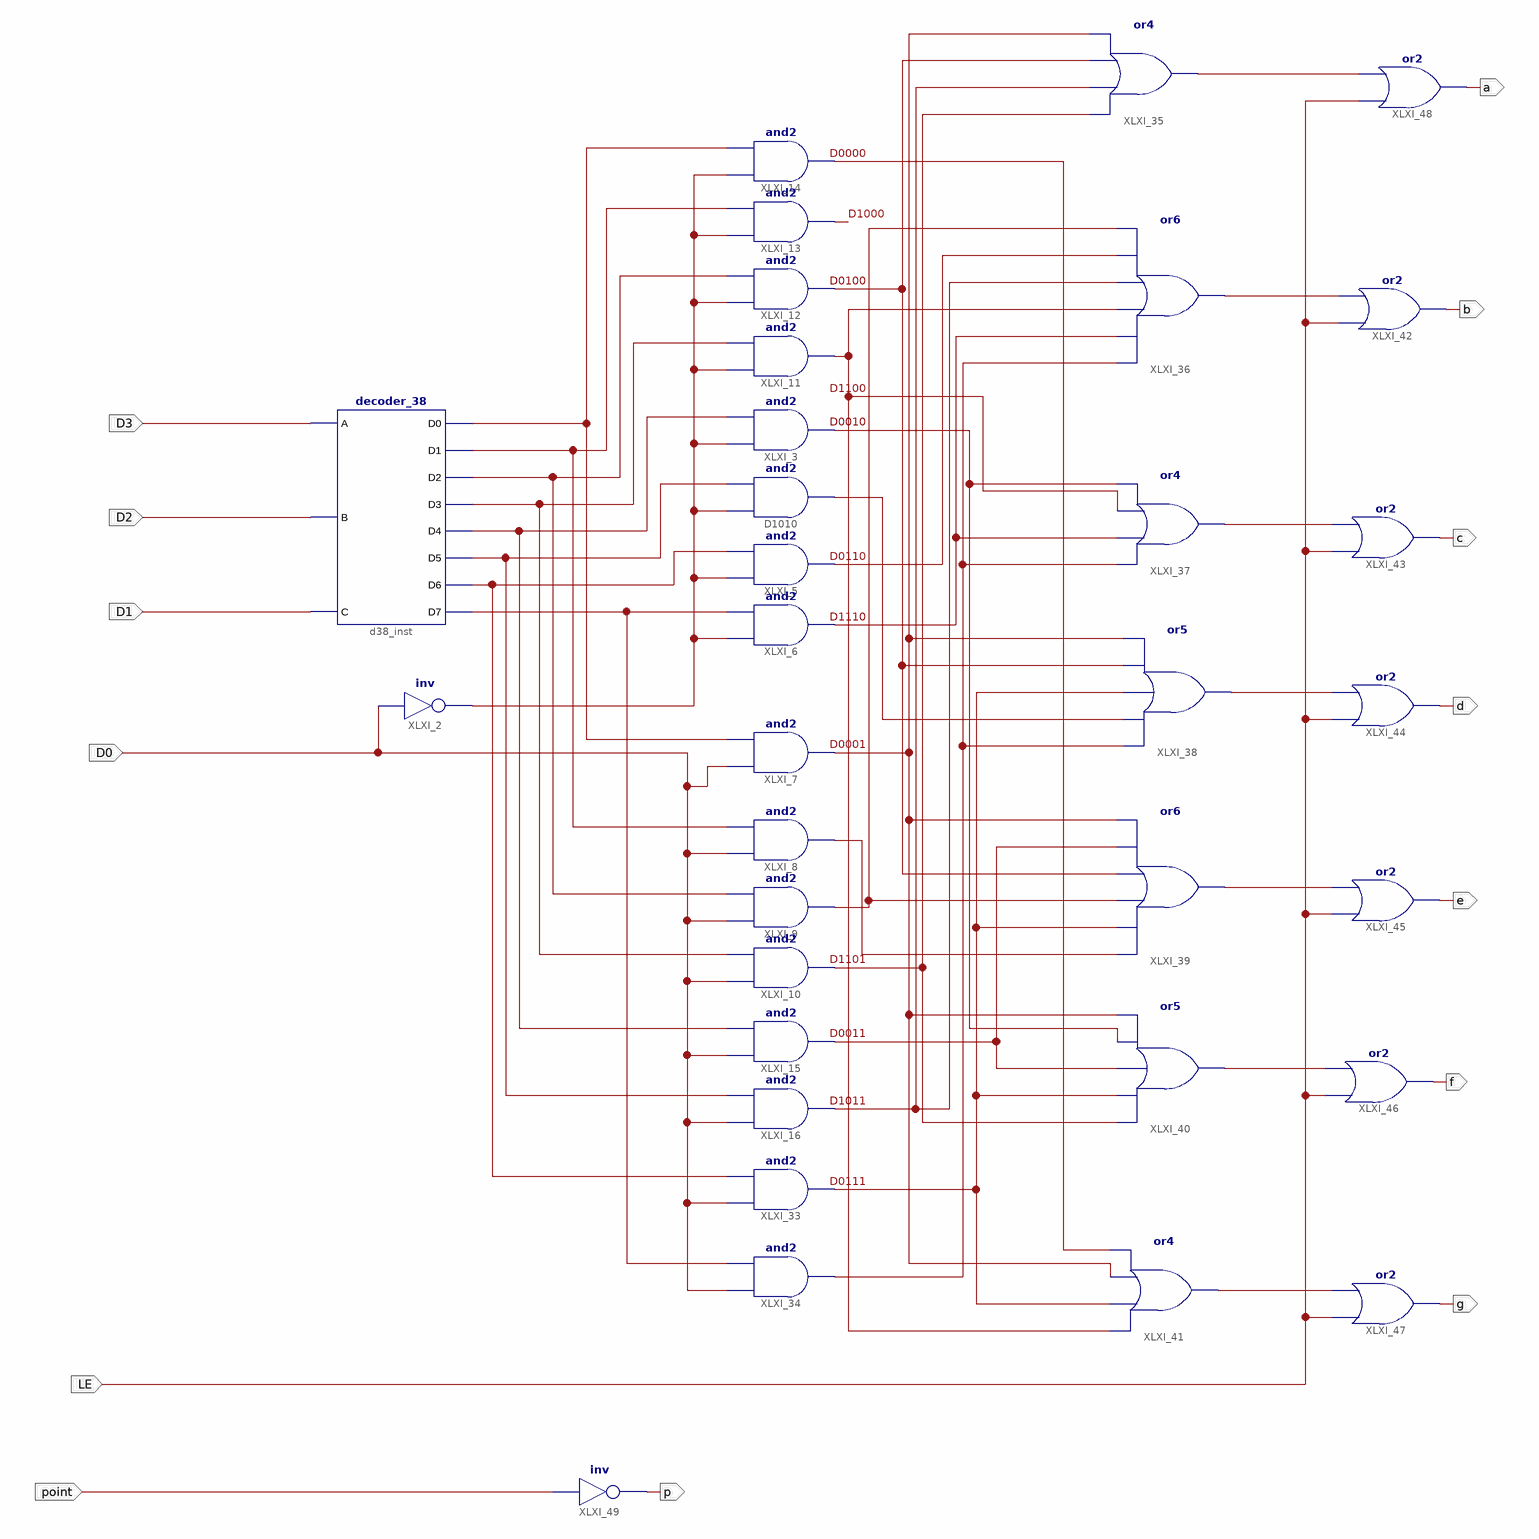
[diagram p0: schematic sheet 1]
// Xilinx ISE schematic MC14495.sch (kintex7) as structural Verilog: 33 symbols, 14 ports
module MC14495 (
  input  D3,
  input  D2,
  input  D1,
  input  D0,
  input  LE,
  input  point,
  output b,
  output c,
  output d,
  output e,
  output f,
  output g,
  output a,
  output p
);

  wire D0000, D0001, D0010, D0011, D0100, D0110, D0111, D1000, D1011, D1100, D1101, D1110, XLXN_18, XLXN_30,
       XLXN_32, XLXN_33, XLXN_34, XLXN_35, XLXN_36, XLXN_37, XLXN_38, XLXN_76, XLXN_82, XLXN_83, XLXN_84,
       XLXN_85, XLXN_86, XLXN_87, XLXN_88, XLXN_99, XLXN_100, XLXN_101;

  decoder_38 d38_inst (
    .A(D3), .B(D2), .C(D1), .D0(XLXN_30), .D1(XLXN_32), .D2(XLXN_33), .D3(XLXN_34), .D4(XLXN_35),
    .D5(XLXN_36), .D6(XLXN_37), .D7(XLXN_38));
  not XLXI_2 (XLXN_18, D0);
  and D1010 (XLXN_76, XLXN_18, XLXN_36);
  and XLXI_5 (D0110, XLXN_18, XLXN_37);
  and XLXI_6 (D1110, XLXN_18, XLXN_38);
  and XLXI_7 (D0001, D0, XLXN_30);
  and XLXI_8 (XLXN_100, D0, XLXN_32);
  and XLXI_9 (XLXN_99, D0, XLXN_33);
  and XLXI_10 (D1101, D0, XLXN_34);
  and XLXI_3 (D0010, XLXN_18, XLXN_35);
  and XLXI_11 (D1100, XLXN_18, XLXN_34);
  and XLXI_12 (D0100, XLXN_18, XLXN_33);
  and XLXI_13 (D1000, XLXN_18, XLXN_32);
  and XLXI_14 (D0000, XLXN_18, XLXN_30);
  and XLXI_15 (D0011, D0, XLXN_35);
  and XLXI_16 (D1011, D0, XLXN_36);
  and XLXI_33 (D0111, D0, XLXN_37);
  and XLXI_34 (XLXN_101, D0, XLXN_38);
  or XLXI_35 (XLXN_88, D1101, D1011, D0100, D0001);
  or XLXI_36 (XLXN_87, XLXN_101, D1110, D1100, D1011, D0110, XLXN_99);
  or XLXI_37 (XLXN_86, XLXN_101, D1110, D1100, D0010);
  or XLXI_38 (XLXN_85, XLXN_101, XLXN_76, D0111, D0100, D0001);
  or XLXI_39 (XLXN_84, XLXN_100, D0111, XLXN_99, D0100, D0011, D0001);
  or XLXI_40 (XLXN_83, D1101, D0111, D0011, D0010, D0001);
  or XLXI_41 (XLXN_82, D1100, D0111, D0001, D0000);
  or XLXI_42 (b, LE, XLXN_87);
  or XLXI_43 (c, LE, XLXN_86);
  or XLXI_44 (d, LE, XLXN_85);
  or XLXI_45 (e, LE, XLXN_84);
  or XLXI_46 (f, LE, XLXN_83);
  or XLXI_47 (g, LE, XLXN_82);
  or XLXI_48 (a, LE, XLXN_88);
  not XLXI_49 (p, point);
endmodule
